# EAGLE design End Effector Board (EAGLE 9.6.2)
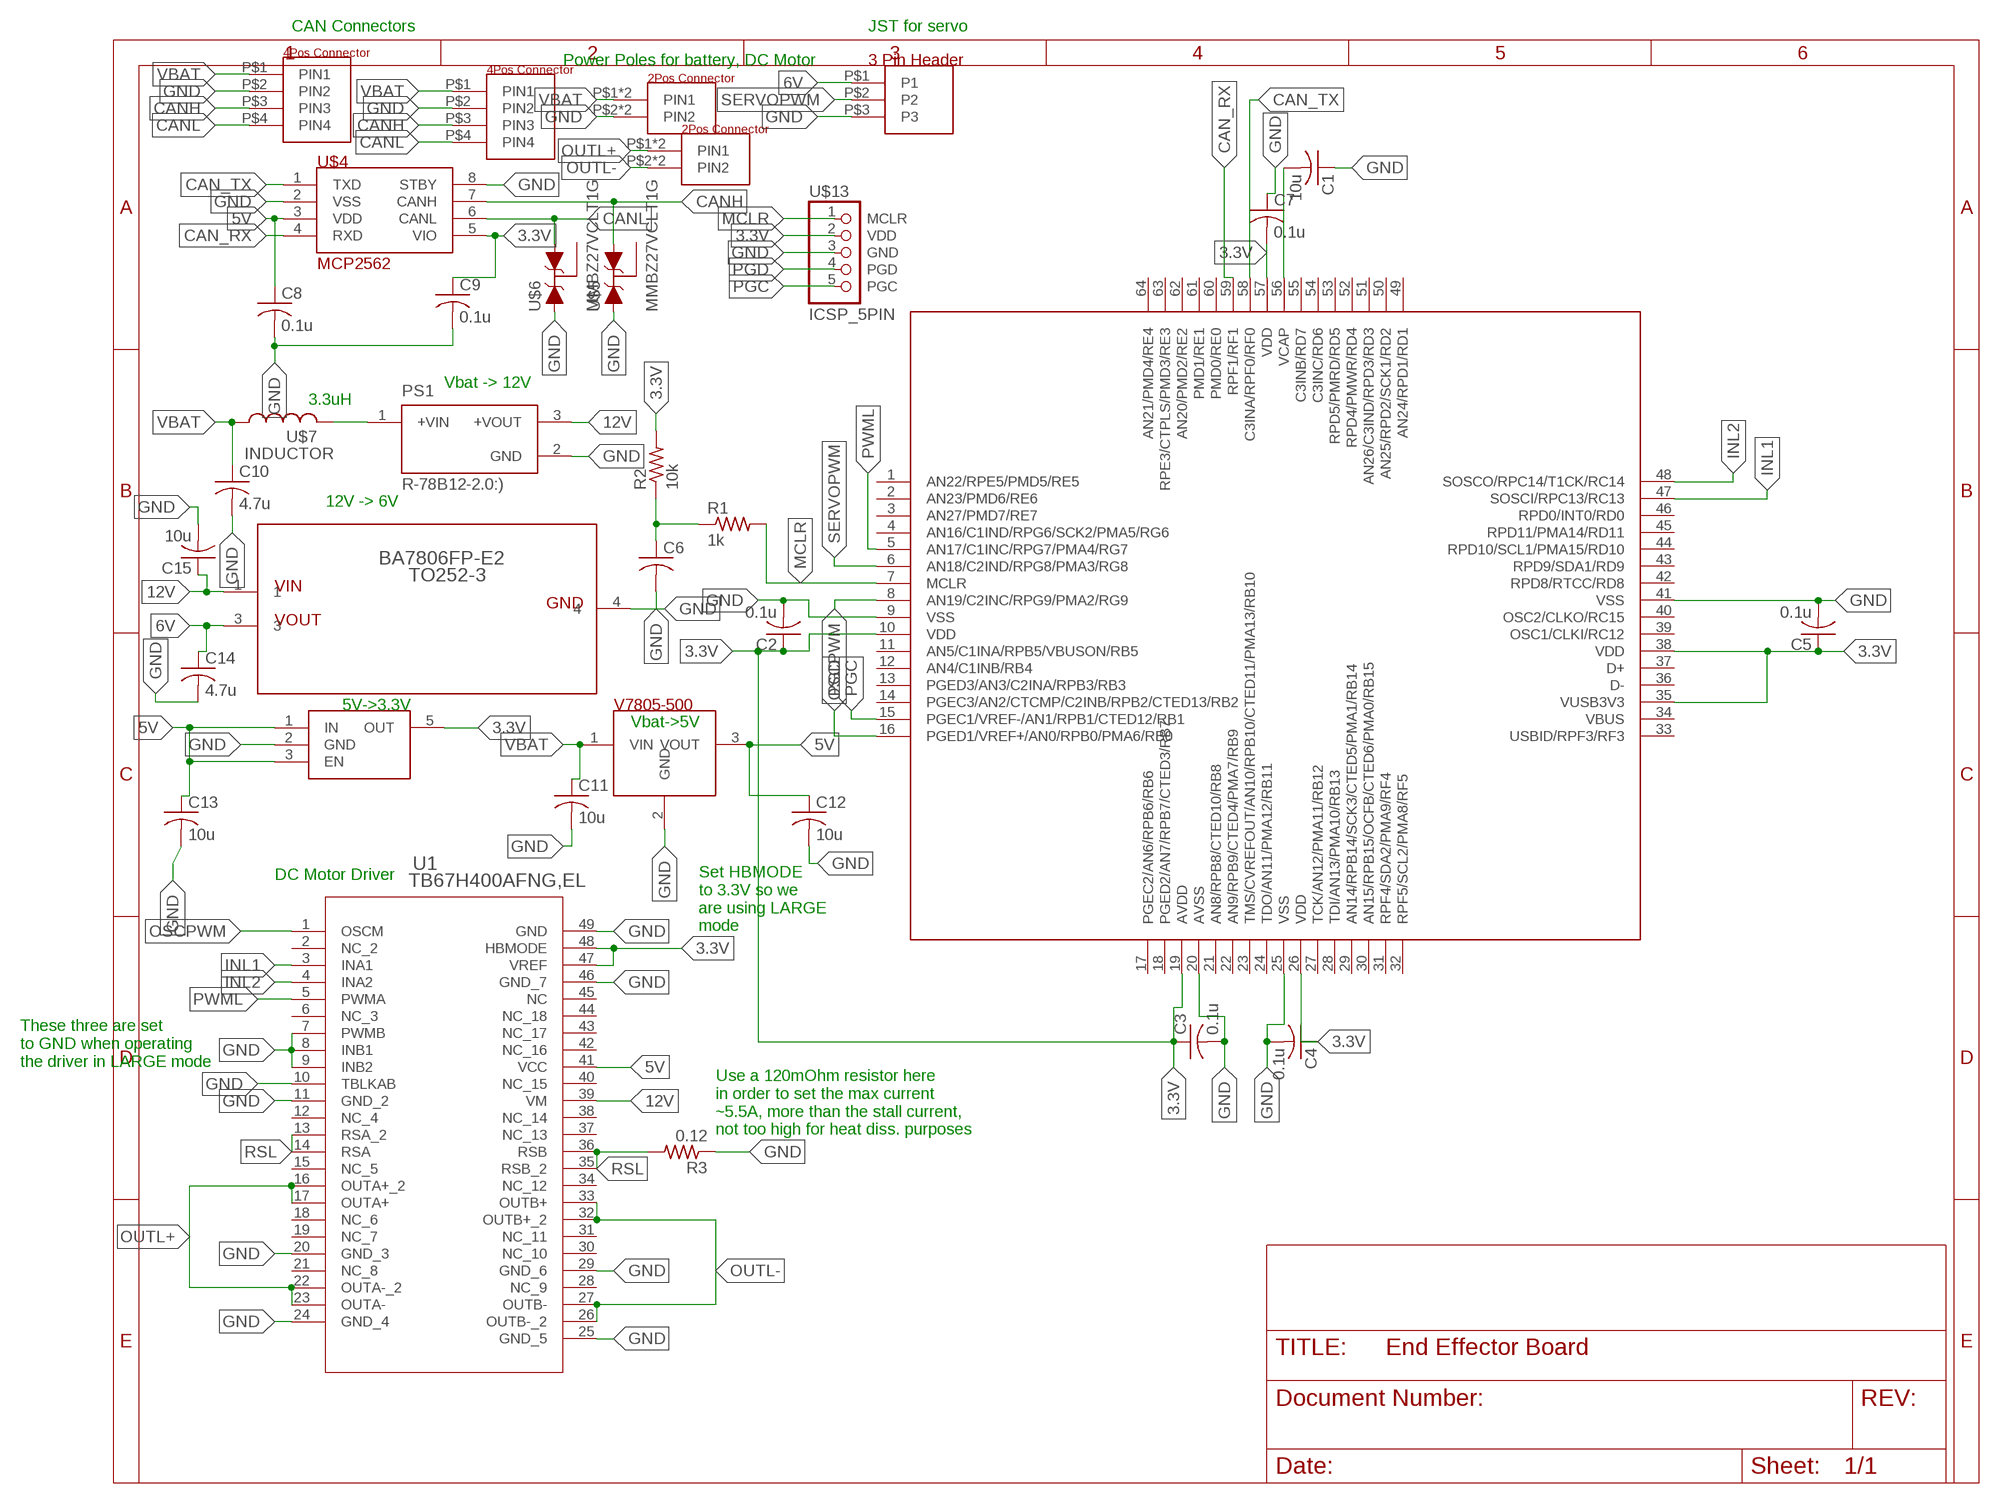
[diagram p0: schematic, sheet 1]

## Parts
BA7806FP-E2  TO252-3  [TO252-3]
C1  10u  C-USC0603  [C0603]
C2  0.1u  C-USC0603  [C0603]
C3  0.1u  C-USC0603  [C0603]
C4  0.1u  C-USC0603  [C0603]
C5  0.1u  C-USC0603  [C0603]
C6  C-USC0603  [C0603]
C7  0.1u  C-USC0603  [C0603]
C8  0.1u  C-USC0603  [C0603]
C9  0.1u  C-USC0603  [C0603]
C10  4.7u  C-USC0603  [C0603]
C11  10u  C-USC0603  [C0603]
C12  10u  C-USC0603  [C0603]
C13  10u  C-USC0603  [C0603]
C14  4.7u  C-USC0603  [C0603]
C15  10u  C-USC0603  [C0603]
PS1  R-78B12-2.0:)  [CONV_R-78B12-2.0]
R1  1k  R-US_R0603  [R0603]
R2  10k  R-US_R0603  [R0603]
R3  0.12  R-US_R0603  [R0603]
U1  TB67H400AFNG,EL  [HTSSOP48-P-300-0P50_TOS]
U$1  4POS_2ROW_CONNECTOR  [4POS_2ROW_HEADER_.1"]
U$2  4POS_2ROW_CONNECTOR  [4POS_2ROW_HEADER_.1"]
U$3  PIC32MX530F128HOLD  [TQFP64-10X10X1MM]
U$4  MCP2562  [SOIC8]
U$5  MMBZ27VCLT1G  [SOT23]
U$6  MMBZ27VCLT1G  [SOT23]
U$7  INDUCTOR  [0603]
U$8  TLV70233DBVR  [SOT-23-5]
U$9  V7805-500  [SIP3]
U$10  2POS_CONNECTOR,1X2_45A_POWERPOLE  [POWERPOLE_45A_1X2]
U$11  2POS_CONNECTOR,1X2_45A_POWERPOLE  [POWERPOLE_45A_1X2]
U$12  3POS_CONNECTORJST-ZH  [3POS_ZH_SIDE]
U$13  ICSP_5PIN  [ICSP_5]

## Nets
3.3V: C2.1 C3.1 C4.1 C5.1 C7.2 C9.1 R2.2 U1.47(VREF) U1.48(HBMODE) U$3.10(VDD) U$3.19(AVDD) U$3.26(VDD) U$3.35(VUSB3V3) U$3.38(VDD) U$3.57(VDD) U$4.5(VIO) U$8.5(OUT) U$13.2(VDD)
5V: C8.1 C12.1 C13.1 U1.41(VCC) U$4.3(VDD) U$8.1(IN) U$8.3(EN) U$9.3(VOUT)
6V: BA7806FP-E2.3 C14.1 U$12.P$1(P1)
12V: BA7806FP-E2.1 C15.1 PS1.3(+VOUT) U1.39(VM)
CAN_RX: U$3.59(RPF1/RF1) U$4.4(RXD)
CAN_TX: U$3.58(C3INA/RPF0/RF0) U$4.1(TXD)
CANH: U$1.P$3(PIN3) U$2.P$3(PIN3) U$4.7(CANH) U$5.2(A2)
CANL: U$1.P$4(PIN4) U$2.P$4(PIN4) U$4.6(CANL) U$6.2(A2)
GND: BA7806FP-E2.4 C1.1 C2.2 C3.2 C4.2 C5.2 C6.2 C7.1 C8.2 C9.2 C10.2 C11.2 C12.2 C13.2 C14.2 C15.2 PS1.2(GND) R3.1 U1.7(PWMB) U1.8(INB1) U1.9(INB2) U1.10(TBLKAB) U1.11(GND_2) U1.20(GND_3) U1.24(GND_4) U1.25(GND_5) U1.29(GND_6) U1.46(GND_7) U1.49(GND) U$1.P$2(PIN2) U$2.P$2(PIN2) U$3.9(VSS) U$3.20(AVSS) U$3.25(VSS) U$3.41(VSS) U$4.2(VSS) U$4.8(STBY) U$5.1(A1) U$6.1(A1) U$8.2(GND) U$9.2(GND) U$10.P$2(PIN2) U$10.P$6(PIN2) U$12.P$3(P3) U$13.3(GND)
INL1: U1.3(INA1) U$3.47(SOSCI/RPC13/RC13)
INL2: U1.4(INA2) U$3.48(SOSCO/RPC14/T1CK/RC14)
MCLR: R1.2 U$3.7(MCLR) U$13.1(MCLR)
N$1: C1.2 U$3.56(VCAP)
N$2: PS1.1(+VIN) U$7.2
N$4: C6.1 R1.1 R2.1
OSCPWM: U1.1(OSCM) U$3.8(AN19/C2INC/RPG9/PMA2/RG9)
OUTL+: U1.16(OUTA+_2) U1.17(OUTA+) U1.22(OUTA-_2) U1.23(OUTA-) U$11.P$1(PIN1) U$11.P$5(PIN1)
OUTL-: U1.26(OUTB-_2) U1.27(OUTB-) U1.32(OUTB+_2) U1.33(OUTB+) U$11.P$2(PIN2) U$11.P$6(PIN2)
PGC: U$3.15(PGEC1/VREF-/AN1/RPB1/CTED12/RB1) U$13.5(PGC)
PGD: U$3.16(PGED1/VREF+/AN0/RPB0/PMA6/RB0) U$13.4(PGD)
PWML: U1.5(PWMA) U$3.5(AN17/C1INC/RPG7/PMA4/RG7)
RSL: R3.2 U1.13(RSA_2) U1.14(RSA) U1.35(RSB_2) U1.36(RSB)
SERVOPWM: U$3.6(AN18/C2IND/RPG8/PMA3/RG8) U$12.P$2(P2)
VBAT: C10.1 C11.1 U$1.P$1(PIN1) U$2.P$1(PIN1) U$7.1 U$9.1(VIN) U$10.P$1(PIN1) U$10.P$5(PIN1)
Unconnected: U1.2(NC_2) U1.6(NC_3) U1.12(NC_4) U1.15(NC_5) U1.18(NC_6) U1.19(NC_7) U1.21(NC_8) U1.28(NC_9) U1.30(NC_10) U1.31(NC_11) U1.34(NC_12) U1.37(NC_13) U1.38(NC_14) U1.40(NC_15) U1.42(NC_16) U1.43(NC_17) U1.44(NC_18) U1.45(NC) U$3.1(AN22/RPE5/PMD5/RE5) U$3.2(AN23/PMD6/RE6) U$3.3(AN27/PMD7/RE7) U$3.4(AN16/C1IND/RPG6/SCK2/PMA5/RG6) U$3.11(AN5/C1INA/RPB5/VBUSON/RB5) U$3.12(AN4/C1INB/RB4) U$3.13(PGED3/AN3/C2INA/RPB3/RB3) U$3.14(PGEC3/AN2/CTCMP/C2INB/RPB2/CTED13/RB2) U$3.17(PGEC2/AN6/RPB6/RB6) U$3.18(PGED2/AN7/RPB7/CTED3/RB7) U$3.21(AN8/RPB8/CTED10/RB8) U$3.22(AN9/RPB9/CTED4/PMA7/RB9) U$3.23(TMS/CVREFOUT/AN10/RPB10/CTED11/PMA13/RB10) U$3.24(TDO/AN11/PMA12/RB11) U$3.27(TCK/AN12/PMA11/RB12) U$3.28(TDI/AN13/PMA10/RB13) U$3.29(AN14/RPB14/SCK3/CTED5/PMA1/RB14) U$3.30(AN15/RPB15/OCFB/CTED6/PMA0/RB15) U$3.31(RPF4/SDA2/PMA9/RF4) U$3.32(RPF5/SCL2/PMA8/RF5) U$3.33(USBID/RPF3/RF3) U$3.34(VBUS) U$3.36(D-) U$3.37(D+) U$3.39(OSC1/CLKI/RC12) U$3.40(OSC2/CLKO/RC15) U$3.42(RPD8/RTCC/RD8) U$3.43(RPD9/SDA1/RD9) U$3.44(RPD10/SCL1/PMA15/RD10) U$3.45(RPD11/PMA14/RD11) U$3.46(RPD0/INT0/RD0) U$3.49(AN24/RPD1/RD1) U$3.50(AN25/RPD2/SCK1/RD2) U$3.51(AN26/C3IND/RPD3/RD3) U$3.52(RPD4/PMWR/RD4) U$3.53(RPD5/PMRD/RD5) U$3.54(C3INC/RD6) U$3.55(C3INB/RD7) U$3.60(PMD0/RE0) U$3.61(PMD1/RE1) U$3.62(AN20/PMD2/RE2) U$3.63(RPE3/CTPLS/PMD3/RE3) U$3.64(AN21/PMD4/RE4) U$5.3(C) U$6.3(C)

## Notes on the sheet
- CAN Connectors | JST for servo
- Power Poles for battery, DC Motor
- Vbat -> 12V
- 3.3uH
- 12V -> 6V
- 5V->3.3V
- Vbat->5V
- DC Motor Driver
- Set HBMODE
  to 3.3V so we
  are using LARGE
  mode
- These three are set
  to GND when operating
  the driver in LARGE mode
- Use a 120mOhm resistor here
  in order to set the max current
  ~5.5A, more than the stall current,
  not too high for heat diss. purposes

## Library data of the parts
BA7806FP-E2 = CMR:TO252-3: 6V 1A regulator
C1-C9 C11-C13 C15 = rcl:C-US: CAPACITOR, American symbol; SPICEPREFIX: C
C10 C14 = CMR:C-US: CAPACITOR, American symbol; SPICEPREFIX: C
PS1 = CMR:R-78B12-2.0:): 2.0 Amp SIP3 Single Output Check prices <https://pricing.snapeda.com/parts/R-78B12-2.0/Recom%20Power/view-part?ref=eda> Check prices <https://pricing.snapeda.com/parts/R-78B12-2.0/Recom%20Power/view-part?ref=eda>; DESCRIPTION: 2A DC/DC-Converter 'INNOLINE' SIP3 reg; DIGI-KEY_PART_NUMBER: 945-3041-ND; MF: Recom Power; MP: R-78B12-2.0; PACKAGE: SIP-3 Recom Power; PURCHASE-URL: https://pricing.snapeda.com/search/part/R-78B12-2.0/?ref=eda; SPICEPREFIX: J
R1-R3 = rcl:R-US_: RESISTOR, American symbol; SPICEPREFIX: R
U1 = CMR:TB67H400AFNG,EL: TB67H400AFNG,EL Motor Driver; COPYRIGHT: Copyright (C) 2021 Ultra Librarian. All rights reserved.; DIGI-KEY_PART_NUMBER_1: TB67H400AFNGELTR-ND; DIGI-KEY_PART_NUMBER_2: TB67H400AFNGELCT-ND; DIGI-KEY_PART_NUMBER_3: TB67H400AFNGELDKR-ND; MANUFACTURER_PART_NUMBER: TB67H400AFNG,EL; MFR_NAME: Toshiba Electronic Devices & Storage Co.
U$1 U$2 = CMR:4POS_2ROW_CONNECTOR
U$3 = CMR:PIC32MX530F128H: 32-bit Microcontrollers (up to 512 KB Flash and 64 KB SRAM) with Audio/Graphics/Touch (HMI), CAN, USB, and Advanced Analog
U$4 = CMR:MCP2562: CAN Transciever with built in level shifter
U$5 U$6 = CMR:MMBZ27VCLT1G: MMBZ27VCLT1G TVS Diode for protecting against ESD events link: https://www.digikey.com/product-detail/en/on-semiconductor/MMBZ27VCLT1G/MMBZ27VCLT1GOSCT-ND/964555
U$7 = CMR:INDUCTOR; SPICEPREFIX: B
U$8 = CMR:TLV70233DBVR: TLV702 300-mA, Low-IQ, Low-Dropout Regulator
U$9 = CMR:V7805-500: Switching regulator (24V to 5V); max output current: 500mA
U$10 U$11 = CMR:2POS_CONNECTOR: Harwin 2mm 2 POS Connector Male - https://www.digikey.com/product-detail/en/harwin-inc/M80-8520242/952-1769-ND/3727738 Female - https://www.digikey.com/product-detail/en/harwin-inc/M80-8980205/952-1182-ND/2264171
U$12 = CMR:3POS_CONNECTOR: 3position header pin
U$13 = CMR:ICSP_5PIN

## Board
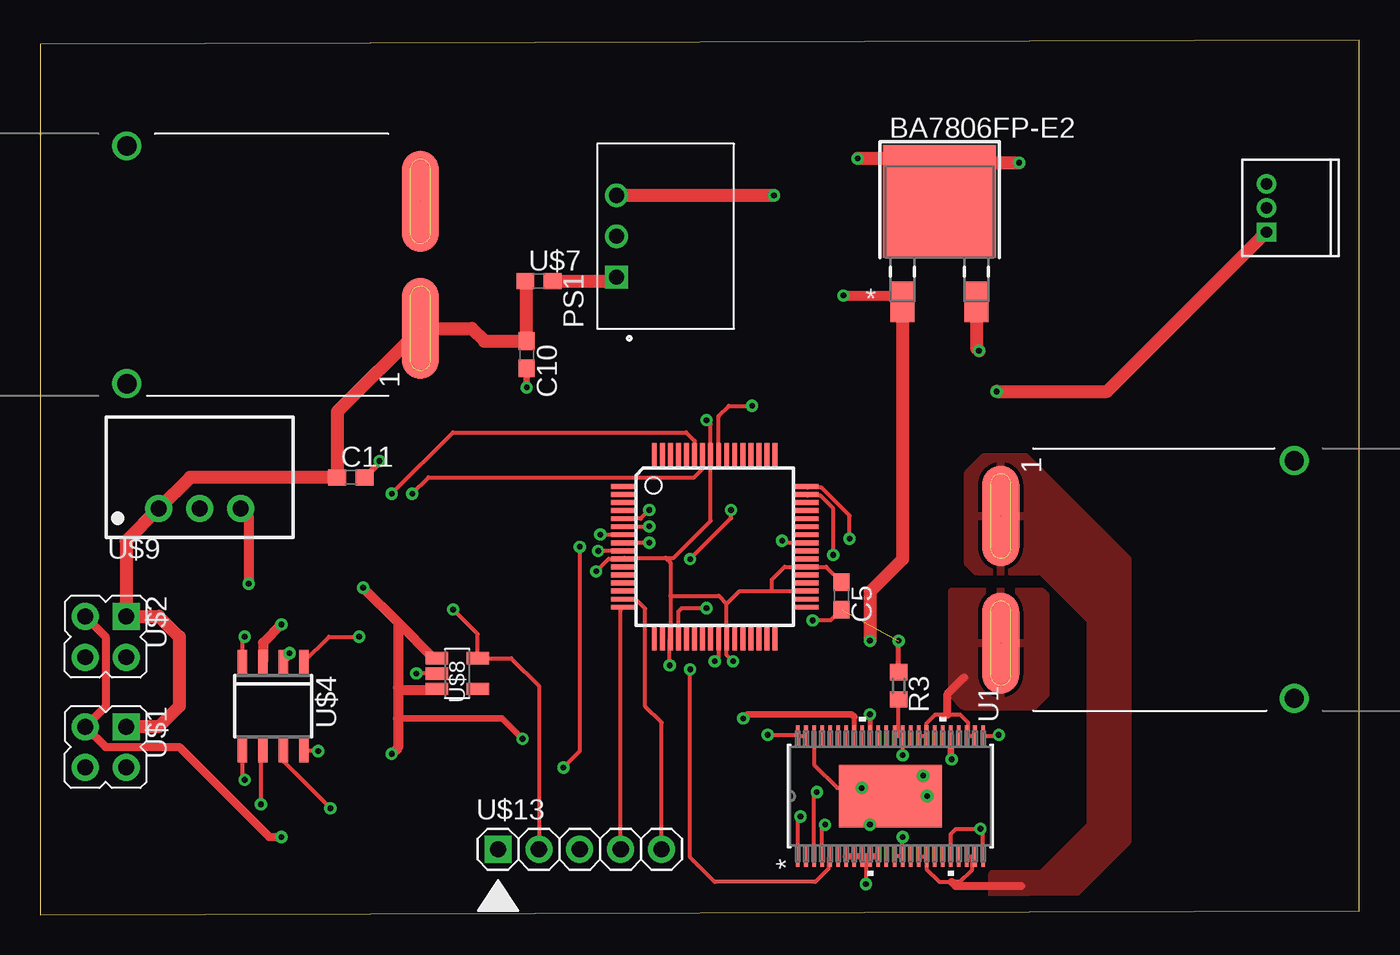
[diagram p1: board, top side]
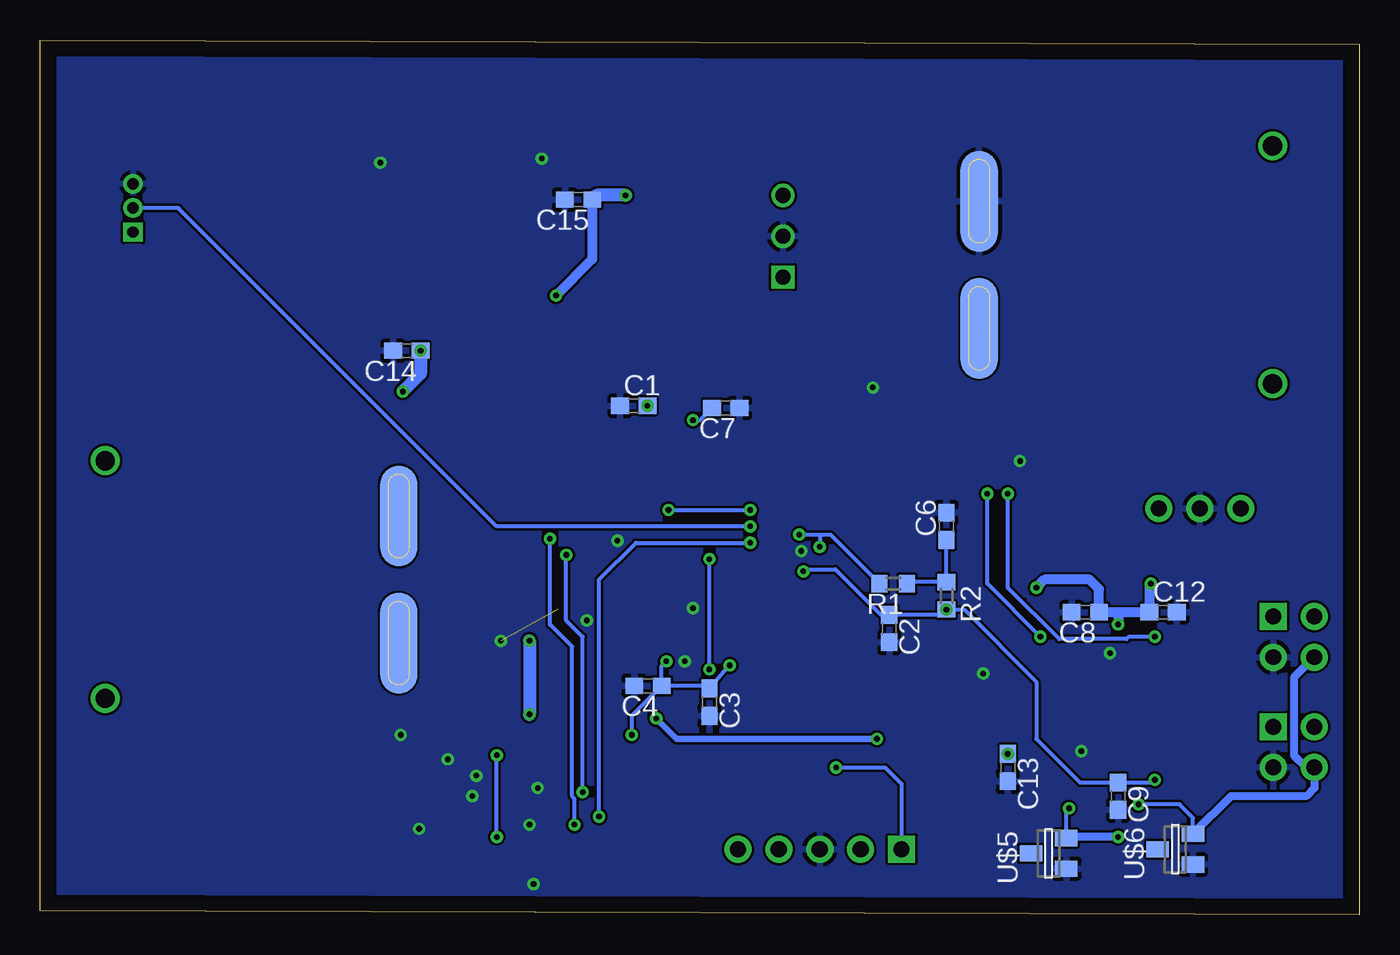
[diagram p2: board, bottom side, seen from below]

Size 81.97 x 54.35 mm. Coordinates in mm from the lower left corner, seen from the top.
Outline: 0,0 81.97,0.25 81.97,54.35 0,54.09 0,0
Copper layers (1*16): Top 0.035mm / dielectric 1.5mm / Bottom 0.035mm
Design rules "default": minimum track width 6mil, minimum drill 0.35mm, track to track 6mil, track to pad 6mil, pad to pad 6mil, via to via 6mil, smd to smd 6mil, copper to edge 40mil, drill to drill 6mil, minimum pad ring 10mil, minimum via ring 8mil, stop-mask expansion 4mil, vias tented up to drill 0mil, thermal gap 10mil

### Footprints (pad centres in the part's own frame; a part is rotated, then mirrored left to right if it is on the bottom)
TO252-3 = smd 1.5 x 2.5: 1 -2.3,-5.6; 3 2.3,-5.6 | smd 7 x 7: 4 0,0.65
C0603 = smd 1.1 x 1: 1 -0.85,0; 2 0.85,0
CONV_R-78B12-2.0 = drill 0.94 square: 1 -2.54,3.05 | drill 0.94: 2 0,3.05; 3 2.54,3.05
R0603 = smd 1 x 1.1: 1 -0.85,0; 2 0.85,0
HTSSOP48-P-300-0P50_TOS = smd 1.311 x 0.22: 1 -3.75,5.75; 2 -3.75,5.25; 3 -3.75,4.75; 4 -3.75,4.25; 5 -3.75,3.75; 6 -3.75,3.25; 7 -3.75,2.75; 8 -3.75,2.25; 9 -3.75,1.75; 10 -3.75,1.25; 11 -3.75,0.75; 12 -3.75,0.25; 13 -3.75,-0.25; 14 -3.75,-0.75; 15 -3.75,-1.25; 16 -3.75,-1.75; 17 -3.75,-2.25; 18 -3.75,-2.75; 19 -3.75,-3.25; 20 -3.75,-3.75; 21 -3.75,-4.25; 22 -3.75,-4.75; 23 -3.75,-5.25; 24 -3.75,-5.75; 25 3.75,-5.75; 26 3.75,-5.25; 27 3.75,-4.75; 28 3.75,-4.25; 29 3.75,-3.75; 30 3.75,-3.25; 31 3.75,-2.75; 32 3.75,-2.25; 33 3.75,-1.75; 34 3.75,-1.25; 35 3.75,-0.75; 36 3.75,-0.25; 37 3.75,0.25; 38 3.75,0.75; 39 3.75,1.25; 40 3.75,1.75; 41 3.75,2.25; 42 3.75,2.75; 43 3.75,3.25; 44 3.75,3.75; 45 3.75,4.25; 46 3.75,4.75; 47 3.75,5.25; 48 3.75,5.75 | smd 3.9 x 6.4: 49 0,0
4POS_2ROW_HEADER_.1" = drill 0.991 pad 1.676 square: P$1 -1.27,1.27 | drill 0.991 pad 1.676: P$2 1.27,1.27; P$3 -1.27,-1.27; P$4 1.27,-1.27
TQFP64-10X10X1MM = smd 1.5 x 0.3: 1 -5.7,3.75; 2 -5.7,3.25; 3 -5.7,2.75; 4 -5.7,2.25; 5 -5.7,1.75; 6 -5.7,1.25; 7 -5.7,0.75; 8 -5.7,0.25; 9 -5.7,-0.25; 10 -5.7,-0.75; 11 -5.7,-1.25; 12 -5.7,-1.75; 13 -5.7,-2.25; 14 -5.7,-2.75; 15 -5.7,-3.25; 16 -5.7,-3.75; 33 5.7,-3.75; 34 5.7,-3.25; 35 5.7,-2.75; 36 5.7,-2.25; 37 5.7,-1.75; 38 5.7,-1.25; 39 5.7,-0.75; 40 5.7,-0.25; 41 5.7,0.25; 42 5.7,0.75; 43 5.7,1.25; 44 5.7,1.75; 45 5.7,2.25; 46 5.7,2.75; 47 5.7,3.25; 48 5.7,3.75 | smd 0.3 x 1.5: 17 -3.75,-5.7; 18 -3.25,-5.7; 19 -2.75,-5.7; 20 -2.25,-5.7; 21 -1.75,-5.7; 22 -1.25,-5.7; 23 -0.75,-5.7; 24 -0.25,-5.7; 25 0.25,-5.7; 26 0.75,-5.7; 27 1.25,-5.7; 28 1.75,-5.7; 29 2.25,-5.7; 30 2.75,-5.7; 31 3.25,-5.7; 32 3.75,-5.7; 49 3.75,5.7; 50 3.25,5.7; 51 2.75,5.7; 52 2.25,5.7; 53 1.75,5.7; 54 1.25,5.7; 55 0.75,5.7; 56 0.25,5.7; 57 -0.25,5.7; 58 -0.75,5.7; 59 -1.25,5.7; 60 -1.75,5.7; 61 -2.25,5.7; 62 -2.75,5.7; 63 -3.25,5.7; 64 -3.75,5.7
SOIC8 = smd 0.6 x 1.5: 1 -1.905,-2.75; 2 -0.635,-2.75; 3 0.635,-2.75; 4 1.905,-2.75; 5 1.905,2.75; 6 0.635,2.75; 7 -0.635,2.75; 8 -1.905,2.75
SOT23 = smd 1 x 1.4: 1 -0.95,-1.1; 2 0.95,-1.1; 3 0,1.1
0603 = smd 1.1 x 1: 1 -0.85,0; 2 0.85,0
SOT-23-5 = smd 0.762 x 1.397: 1 -0.953,-1.27; 2 0,-1.27; 3 0.953,-1.27; 4 0.953,1.27; 5 -0.953,1.27
SIP3 = drill 1 pad 1.676: 1 -2.54,-1.943; 2 0,-1.943; 3 2.54,-1.943
POWERPOLE_45A_1X2 = smd 6.246 x 2.286: P$1 -3.95,0; P$2 3.95,0 | drill 1.2: P$3 -7.39,18.24; P$4 7.39,18.24 | smd 6.246 x 2.286 bottom: P$5 -3.95,0; P$6 3.95,0
3POS_ZH_SIDE = drill 0.7 square: P$1 0,0 | drill 0.7: P$2 1.5,0; P$3 3,0
ICSP_5 = drill 1.016 pad 1.676 square: 1 -5.08,0 | drill 1.016 pad 1.676: 2 -2.54,0; 3 0,0; 4 2.54,0; 5 5.08,0

### Placement (x,y rotation side)
BA7806FP-E2  55.88,43.69 0 top
C1  45.09,31.62 0 bottom
C2  29.21,17.78 270 bottom
C3  40.39,13.21 270 bottom
C4  44.2,14.22 180 bottom
C5  49.78,19.81 270 top
C6  25.65,24.13 90 bottom
C7  39.37,31.5 180 bottom
C8  17.02,18.8 180 bottom
C9  14.99,7.37 270 bottom
C10  30.23,34.8 270 top
C11  19.3,27.18 0 top
C12  12.19,18.8 0 bottom
C13  21.84,9.14 270 bottom
C14  59.18,35.05 180 bottom
C15  48.51,44.45 180 bottom
PS1  38.86,42.16 90 top
R1  28.96,20.57 180 bottom
R2  25.65,19.81 270 bottom
R3  53.34,14.22 270 top
U1  52.83,7.37 90 top
U$1  4.06,10.41 270 top
U$2  4.06,17.27 270 top
U$3  41.91,22.86 0 top
U$4  14.48,12.95 180 top
U$5  19.3,3.81 90 bottom
U$6  11.43,4.06 90 bottom
U$7  30.99,39.37 0 top
U$8  25.91,14.99 270 top
U$9  9.91,27.18 0 top
U$10  23.62,40.39 90 top
U$11  59.69,20.83 270 top
U$12  76.2,42.42 90 top
U$13  33.53,4.06 0 top

### Tracks (layer width: path | path; a pad name or v marks a point on that pad's centre or on a via)
3.3V  (via drill 0.35)
  Top 0.254: R2.2 27.18,17.44 U$8.5 29.27,15.94 30.99,14.22 U$13.2 | v34.54,21.34 35.32,22.11 U$3.10 36.28,22.18 38.86,22.18 | 38.86,22.18 39.36,22.18 41.66,24.48 U$3.57 41.66,30.48 v41.4,30.73 | v12.7,8.38 12.57,8.51 U$4.5 | U1.47 U1.48 47.02,11.18 v45.21,11.18 | v39.12,15.49 39.12,17.12 U$3.19 39.16,19.81 | v43.05,15.75 42.66,16.14 U$3.26 42.66,19.32 | 38.86,22.18 39.16,21.88 39.16,19.81 | 39.16,19.81 42.16,19.81 42.66,19.32 | 42.66,19.32 43.45,20.11 45.47,20.11 | 45.47,20.11 U$3.35 | 45.47,20.11 45.47,20.83 46.25,21.61 U$3.38 48.84,21.61 C5.1
  Bottom 0.254: v34.54,21.34 34.42,21.46 32.55,21.46 29.72,18.63 C2.1 25.99,18.63 R2.2 24.55,18.96 20.07,14.48 20.07,10.92 17.36,8.22 C9.1 12.87,8.22 v12.7,8.38 | v39.12,15.49 39.28,15.33 C3.1 40.55,14.22 C4.1 | C4.1 43.35,15.46 v43.05,15.75 | C4.1 45.21,12.36 v45.21,11.18 | v41.4,30.73 40.98,30.73 C7.2
  other vias: 25.65,18.96
5V  (via drill 0.35)
  Top 0.254: 24.57,16 U$8.1
  Top 0.305: U1.41 50.58,12.28
  Top 0.406: 50.58,12.28 50.42,12.45 43.94,12.45 v43.69,12.19 | 22.23,12.19 28.7,12.19 v29.97,10.92
  Top 0.61: U$9.3 12.95,24.73 v12.95,20.57 | v14.99,18.03 13.84,16.89 U$4.3 | v20.07,20.32 22.23,18.16 | 22.23,18.16 24.38,16 24.57,16 | 22.23,18.16 22.23,14.1 | 22.23,14.1 22.35,13.97 24.57,13.97 U$8.3 | 22.23,14.1 22.23,12.19 22.23,10.38 C13.1
  Bottom 0.254: 13.21,18.96 C12.1
  Bottom 0.406: v29.97,10.92 42.42,10.92 v43.69,12.19
  Bottom 0.61: v12.95,20.57 13.04,20.49 C12.1 14.99,18.8 | 14.99,18.8 C8.1 16.17,20.23 16.76,20.83 19.56,20.83 v20.07,20.32 | 14.99,18.8 v14.99,18.03
  other vias: 21.84,9.99
6V  (via drill 0.35)
  Top 0.813: BA7806FP-E2.3 58.18,35.2 C14.1 | v59.44,32.51 66.29,32.51 U$12.P$1
  Bottom 0.813: C14.1 58.33,33.62 v59.44,32.51
  other vias: 58.33,35.05
12V  (via drill 0.35)
  Top 0.305: U1.39 51.58,12.43
  Top 0.406: 51.58,12.43 v51.56,12.45
  Top 0.61: v49.91,38.48 53.19,38.48 BA7806FP-E2.1
  Top 0.813: BA7806FP-E2.1 53.58,22.08 51.56,20.07 v51.56,17.02 | PS1.3 v45.59,44.7
  Bottom 0.61: C15.1 47.66,40.73 v49.91,38.48
  Bottom 0.813: v51.56,17.02 v51.56,12.45 | v45.59,44.7 47.41,44.7 C15.1
CAN_RX  (via drill 0.35)
  Top 0.254: U$4.4 12.57,17.14 v12.7,17.27 | v21.84,26.16 25.65,29.97 40.13,29.97 40.66,29.44 U$3.59
  Bottom 0.254: v21.84,26.16 21.84,20.32 18.65,17.12 14.46,17.12 14.31,17.27 v12.7,17.27
CAN_TX  (via drill 0.35)
  Top 0.254: U$4.1 17.95,17.27 v19.81,17.27 | v23.11,26.16 24.13,27.18 40.64,27.18 41.16,27.7 U$3.58
  Bottom 0.254: v19.81,17.27 23.11,20.57 v23.11,26.16
CANH  (via drill 0.35)
  Top 0.254: v18.03,6.6 15.11,9.53 U$4.7
  Top 0.508: U$2.P$3 4.06,17.27 4.06,12.95 U$1.P$3 4.06,10.41 8.64,10.41 14.22,4.83 v14.99,4.83
  Bottom 0.254: U$5.2 18.2,6.43 v18.03,6.6
  Bottom 0.508: v14.99,4.83 18.14,4.83 U$5.2
CANL  (via drill 0.35)
  Top 0.254: v13.72,6.86 13.72,10.08 U$4.6
  Bottom 0.254: U$6.2 10.33,6.01 11.18,6.86 v13.72,6.86
  Bottom 0.508: U$2.P$4 4.06,14.73 4.06,9.91 3.3,9.14 U$1.P$4 2.79,7.87 3.3,7.37 7.98,7.37 U$6.2
GND  (via drill 0.35)  (2 unrouted)
  Top 0.254: C5.2 49.11,18.29 v48.01,18.29 | U$4.8 17.23,10.2 v17.27,10.16 | U$8.2 v23.37,14.99 | U1.46 48.08,9.32 49.53,7.87 v51.05,7.87 | U$3.25 42.16,16 v41.91,15.75 | U$3.20 39.66,18.83 39.88,19.05 v41.4,19.05 | U$3.9 v34.67,22.61 | U$3.41 46.23,23.11 v46.1,23.24 | U1.9 51.31,3.39 v51.31,1.91 | U1.24 58.58,5.17 v58.42,5.33 56.9,5.33 56.58,5.02 U1.20 | U1.25 59.5,11.12 v59.56,11.18
  Top 0.305: R3.1 v53.34,17.02
  Top 0.406: C10.2 v30.23,32.77 | C11.2 21.08,28.11 v21.08,28.19 | U$4.2 15.49,16.09 v15.49,16.26 | U1.49 51.56,6.1 v51.56,5.59 | U1.7 U1.8 U1.9 | U1.9 U1.10 U1.11 | U1.9 51.05,3.59 | U1.29 56.58,9.71 v56.64,9.65 | U1.49 52.32,7.87 v51.05,7.87 | U1.49 v55.12,7.37 | U1.49 53.59,7.37 v54.86,8.64
  Top 0.813: v60.83,46.74 58.28,46.74 BA7806FP-E2.4 53.23,46.99 v50.8,46.99
  pour Bottom: 81.97,0.25 -1.02,0 -1.02,54.09 81.97,54.35
INL1  (via drill 0.35)
  Top 0.254: U1.3 48.08,7.44 v48.26,7.62 | U$3.47 47.68,26.04 48.48,26.04 49.28,25.24 v49.28,22.35
  Bottom 0.254: v48.26,7.62 48.26,17.27 49.28,18.29 v49.28,22.35
INL2  (via drill 0.35)
  Top 0.254: U1.4 48.58,5.4 v48.77,5.59 | U$3.48 47.68,26.54 48.55,26.54 50.29,24.8 v50.29,23.37
  Bottom 0.254: v48.77,5.59 48.77,7.2 48.92,7.35 48.92,16.66 50.29,18.03 v50.29,23.37
MCLR  (via drill 0.35)
  Top 0.254: v34.8,23.62 36.2,23.62 U$3.7 | v33.53,22.86 33.53,10.16 v32.51,9.14
  Bottom 0.254: v34.8,23.62 33.53,23.62 | 33.53,23.62 32.85,23.62 R1.2 | 33.53,23.62 v33.53,22.86 | v32.51,9.14 29.46,9.14 28.45,8.13 U$13.1
N$1  (via drill 0.35)
  Top 0.254: C1.2 42.8,31.62 42.16,30.98 U$3.56
  other vias: 44.23,31.62
N$2
  Top 0.813: U$7.2 35.56,39.37 PS1.1
N$4
  Bottom 0.254: R1.1 28.02,20.66 R2.1 C6.1
OSCPWM  (via drill 0.35)
  Top 0.254: U1.1 47.08,5.93 v47.24,6.1 | v37.85,23.11 v37.84,23.11 U$3.8
  Bottom 0.254: v47.24,6.1 47.24,20.83 44.96,23.11 v37.85,23.11
OUTL+  (1 unrouted)
  Top 0.254: U1.22 57.91,3.62 | 57.91,3.62 U1.23 | U1.16 U1.17 55.08,2.83 55.88,2.03 56.64,2.03 57.15,2.03 57.91,2.79 57.91,3.62
  Top 0.508: 56.64,2.03 56.9,1.78 60.96,1.78
  pour Top: 59.18,2.54 62.23,2.54 65.28,5.59 65.28,18.29 62.23,21.34 58.17,21.34 57.66,21.84 57.66,27.43 58.67,28.45 61.21,28.45 67.56,22.1 67.56,4.57 64.01,1.02 59.18,1.02
OUTL-  (1 unrouted)
  Top 0.254: U1.33 U1.32 55.08,11.9 55.63,12.45 56.39,12.45 57.15,12.45 57.66,11.94 57.66,11.12 | U1.27 57.66,11.12 | 57.66,11.12 U1.26
  Top 0.508: 56.39,12.45 56.39,13.72 57.4,14.73
  pour Top: 62.48,13.72 62.48,19.81 62.23,20.07 56.64,20.07 56.64,13.72 57.4,12.95 61.72,12.95
PGC
  Top 0.254: U$13.5 38.61,11.94 37.59,12.95 37.59,19.02 37.01,19.61 U$3.15
PGD
  Top 0.254: U$13.4 36.07,18.97 U$3.16
PWML  (via drill 0.35)
  Top 0.254: U1.5 48.99,3.52 48.99,2.86 48.16,2.03 41.91,2.03 40.39,3.56 v40.39,15.24 | v40.39,22.1 42.93,24.64 v42.93,25.15 | v37.85,25.15 37.31,24.61 U$3.5
  Bottom 0.254: v40.39,15.24 v40.39,22.1 | v42.93,25.15 v37.85,25.15
RSL  (via drill 0.35)
  Top 0.254: U1.36 53.34,11.12 | 53.34,11.12 U1.35 53.59,11.1 v53.59,9.91 | U1.13 U1.14 53.58,4.81 v53.59,4.83 | 53.34,11.12 R3.2
  Bottom 0.254: v53.59,4.83 v53.59,9.91
SERVOPWM  (via drill 0.35)
  Top 0.254: U$3.6 36.23,24.13 v37.85,24.13
  Bottom 0.254: v37.85,24.13 53.59,24.13 73.38,43.92 U$12.P$2
VBAT  (1 unrouted)
  Top 0.813: U$7.1 30.23,39.28 C10.1 27.6,35.65 26.81,36.44 U$10.P$5 18.45,31.27 C11.1 9.31,27.18 U$9.1 5.33,23.2 U$2.P$1 7.37,18.54 8.64,17.27 8.64,12.95 7.37,11.68 U$1.P$1